# EAGLE design LPC_2TE_3.4 (EAGLE 5.03)
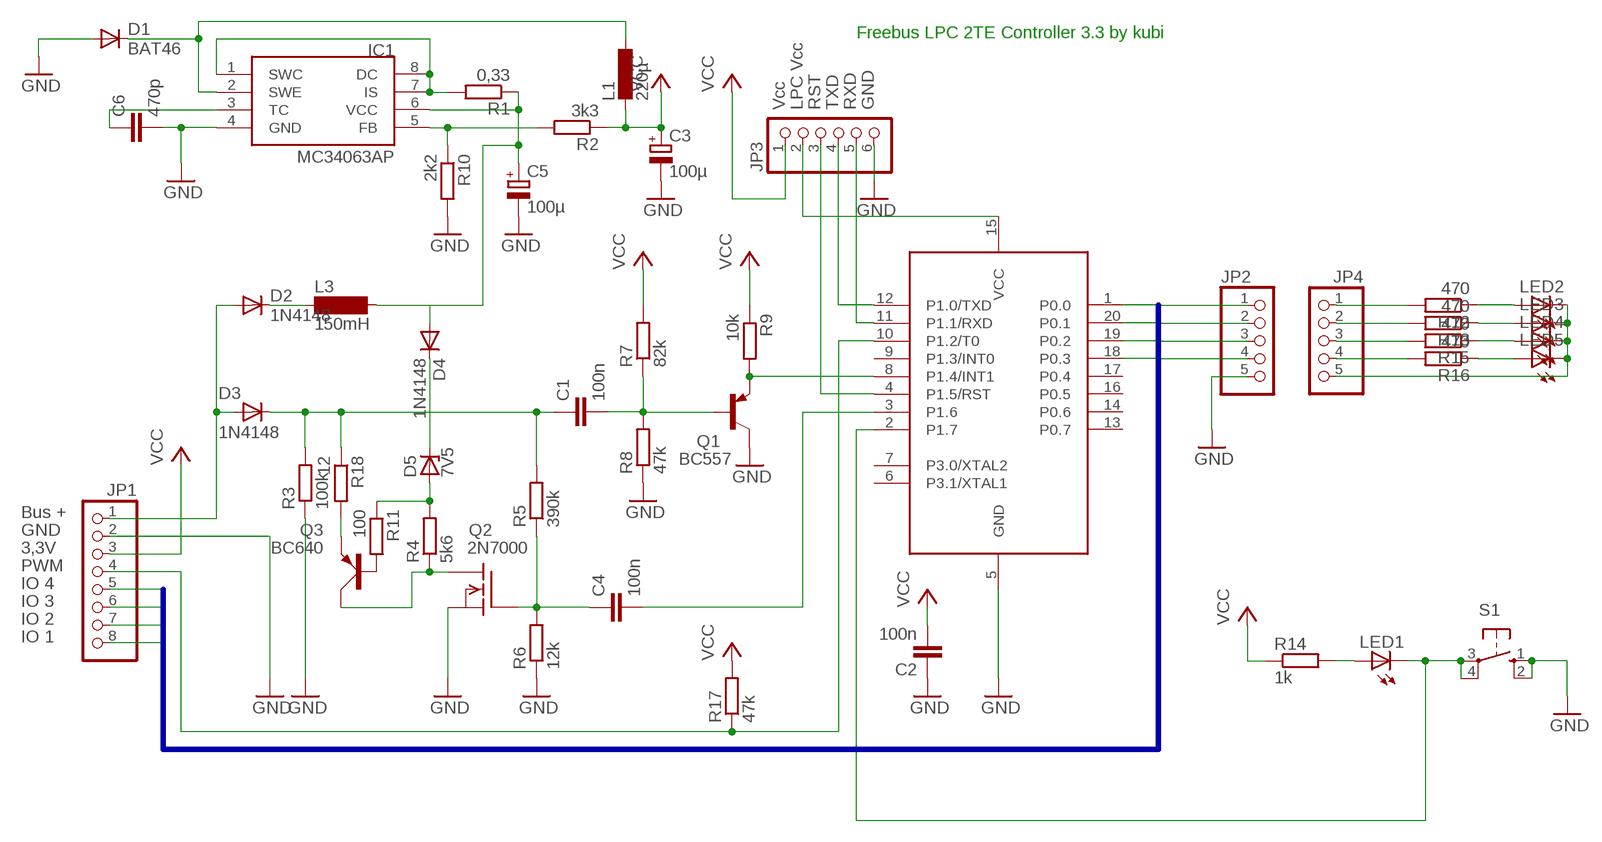
[diagram p0: schematic, sheet 1]

## Parts
C1  100n  C-EU050-024X044  [C050-024X044]
C2  100n  C-EU050-024X044  [C050-024X044]
C3  100µ  CPOL-EUE3.5-8  [E3,5-8]
C4  100n  C-EU050-024X044  [C050-024X044]
C5  100µ  CPOL-EUE3.5-8  [E3,5-8]
C6  470p  C-EU025-024X044  [C025-024X044]
D1  BAT46  BAT81  [DO34-7]
D2  1N4148  [DO35-10]
D3  1N4148  DO35-STEHEND  [DO35-S]
D4  1N4148  [DO35-10]
D5  7V5  ZPD  [DO35Z10]
IC1  MC34063AP  [DIL08]
JP1  PINHD-1X8  [1X08]
JP2  PINHD-1X5  [1X05]
JP3  PINHD-1X6  [1X06]
JP4  PINHD-1X5  [1X05]
L1  220µ  L-EU0207/2V  [0207/2V]
L3  150mH  BS11  [BS11]
LED1  LED3MM  [LED3MM]
LED2  LED3MM  [LED3MM]
LED3  LED3MM  [LED3MM]
LED4  LED3MM  [LED3MM]
LED5  LED3MM  [LED3MM]
Q1  BC557  [TO92]
Q2  2N7000  VN2222KM  [TO237]
Q3  BC640  [SOT54D]
R1  0,33  R-EU_0207/2V  [0207/2V@1]
R2  3k3  R-EU_0207/2V  [0207/2V@1]
R3  100k  R-EU_0207/2V  [0207/2V@1]
R4  5k6  R-EU_0207/2V  [0207/2V@1]
R5  390k  R-EU_0207/2V  [0207/2V@1]
R6  12k  R-EU_0207/2V  [0207/2V@1]
R7  82k  R-EU_0207/2V  [0207/2V@1]
R8  47k  R-EU_0207/2V  [0207/2V@1]
R9  10k  R-EU_0207/2V  [0207/2V@1]
R10  2k2  R-EU_0207/2V  [0207/2V@1]
R11  100  R-EU_0207/2V  [0207/2V@1]
R12  470  R-EU_0207/10  [0207/10@1]
R13  470  R-EU_0207/10  [0207/10@1]
R14  1k  R-EU_0207/2V  [0207/2V@1]
R15  470  R-EU_0207/10  [0207/10@1]
R16  470  R-EU_0207/10  [0207/10@1]
R17  47k  R-EU_0207/2V  [0207/2V@1]
R18  12  R-EU_0207/2V  [0207/2V@1]
S1  10-XX  [B3F-10XX]
U1  89LPC922  [DIL20]

## Nets
GND: C2.1 C3.- C5.- C6.2 D1.A IC1.4(GND) JP1.2 JP2.5 JP3.6 Q1.3(C) Q2.3(S) R3.1 R6.1 R8.1 R10.2 S1.1(S) S1.2(S1) U1.5(GND)
N$1: Q1.1(E) R9.2 U1.8(P1.4/INT1)
N$2: C1.2 Q1.2(B) R7.1 R8.2
N$3: JP1.4 R17.1 U1.10(P1.2/T0)
N$4: C1.1 D3.P$2(B) R3.2 R5.2 R18.1
N$5: C4.2 U1.3(P1.6)
N$6: D2.A D3.P$1(A) JP1.1
N$7: LED1.K(C) S1.3(P) S1.4(P1) U1.2(P1.7)
N$8: IC1.1(SWC) IC1.7(IS) IC1.8(DC) R1.2
N$9: LED1.A R14.2
N$10: C5.+ D4.A IC1.6(VCC) L3.2 R1.1
N$11: IC1.5(FB) R2.2 R10.1
N$12: D1.C IC1.2(SWE) L1.1
N$13: D2.C L3.1
N$14: C6.1 IC1.3(TC)
N$15: D4.C D5.C
N$16: JP4.1 R12.2
N$17: JP4.2 R13.2
N$18: JP4.3 R15.2
N$19: JP4.4 R16.2
N$20: LED2.A R12.1
N$21: LED3.A R13.1
N$22: LED4.A R15.1
N$23: LED5.A R16.1
N$24: JP4.5 LED2.K(C) LED3.K(C) LED4.K(C) LED5.K(C)
N$25: D5.A R4.2 R11.1
N$26: Q2.1(D) Q3.C R4.1
N$28: Q3.B R11.2
N$29: JP3.4 U1.12(P1.0/TXD)
N$30: JP3.5 U1.11(P1.1/RXD)
N$31: JP3.3 U1.4(P1.5/RST)
N$32: JP3.2 U1.15(VCC)
N$33: Q3.E R18.2
N$34: C4.1 Q2.2(G) R5.1 R6.2
P0.0: JP1.8 JP2.1 U1.1(P0.0)
P0.1: JP1.7 JP2.2 U1.20(P0.1)
P0.2: JP1.6 JP2.3 U1.19(P0.2)
P0.3: JP1.5 JP2.4 U1.18(P0.3)
VCC: C2.2 C3.+ JP1.3 JP3.1 L1.2 R2.1 R7.2 R9.1 R14.1 R17.2
Unconnected: U1.6(P3.1/XTAL1) U1.7(P3.0/XTAL2) U1.9(P1.3/INT0) U1.13(P0.7) U1.14(P0.6) U1.16(P0.5) U1.17(P0.4)

## Buses
P0.[0..3]

## Notes on the sheet
- Freebus LPC 2TE Controller 3.3 by kubi
- Vcc | LPC Vcc | RST | TXD | RXD | GND
- Bus +
- GND
- 3,3V
- PWM
- IO 4
- IO 3
- IO 2
- IO 1

## Library data of the parts
C1 C2 C4 C6 = rcl:C-EU: CAPACITOR, European symbol
C3 C5 = rcl:CPOL-EU: POLARIZED CAPACITOR, European symbol
D1 = diode:BAT81: DIODE barrier diode
D2 D4 = diode:1N4148: DIODE high speed (Philips)
D3 = kubi:DO35-STEHEND
D5 = diode:ZPD: Z DIODE 500 mW
IC1 = mc34063:MC34063
JP1 = pinhead:PINHD-1X8: PIN HEADER
JP2 JP4 = pinhead:PINHD-1X5: PIN HEADER
JP3 = pinhead:PINHD-1X6: PIN HEADER
L1 = rcl:L-EU: INDUCTOR, European symbol
L3 = inductor-neosid:BS: INDUCTOR nominal inductance, magnetically screened
LED1-LED5 = led:LED: LED OSRAM: - CHIPLED LG R971, LG N971, LY N971, LG Q971, LY Q971, LO R971, LY R971 LH N974, LH R974 LS Q976, LO Q976, LY Q976 LO Q996 - Hyper CHIPLED LW Q18S LB Q993, LB Q99A, LB R99A - SideLED LS A670, LO A670, LY A670, LG A670, LP A670 LB A673, LV A673, LT A673, LW A673 LH A674 LY A675 LS A676, LA A676, LO A676, LY A676, LW A676 LS A679, LY A679, LG A679 - Hyper Micro SIDELED® LS Y876, LA Y876, LO Y876, LY Y876 LT Y87S - SmartLED LW L88C, LW L88S LB L89C, LB L89S, LG L890 LS L89K, LO L89K, LY L89K LS L896, LA L896, LO L896, LY L896 - TOPLED LS T670, LO T670, LY T670, LG T670, LP T670 LSG T670, LSP T670, LSY T670, LOP T670, LYG T670 LG T671, LOG T671, LSG T671 LB T673, LV T673, LT T673, LW T673 LH T674 LS T676, LA T676, LO T676, LY T676, LB T676, LH T676, LSB T676, LW T676 LB T67C, LV T67C, LT T67C, LS T67K, LO T67K, LY T67K, LW E67C LS E67B, LA E67B, LO E67B, LY E67B, LB E67C, LV E67C, LT E67C LW T67C LS T679, LY T679, LG T679 LS T770, LO T770, LY T770, LG T770, LP T770 LB T773, LV T773, LT T773, LW T773 LH T774 LS E675, LA E675, LY E675, LS T675 LS T776, LA T776, LO T776, LY T776, LB T776 LHGB T686 LT T68C, LB T68C - Hyper Mini TOPLED® LB M676 - Mini TOPLED Santana® LG M470 LS M47K, LO M47K, LY M47K Source: http://www.osram.convergy.de - LUMILED® LXK2-PW12-R00, LXK2-PW12-S00, LXK2-PW14-U00, LXK2-PW14-V00 LXK2-PM12-R00, LXK2-PM12-S00, LXK2-PM14-U00 LXK2-PE12-Q00, LXK2-PE12-R00, LXK2-PE12-S00, LXK2-PE14-T00, LXK2-PE14-U00 LXK2-PB12-K00, LXK2-PB12-L00, LXK2-PB12-M00, LXK2-PB14-N00, LXK2-PB14-P00, LXK2-PB14-Q00 LXK2-PR12-L00, LXK2-PR12-M00, LXK2-PR14-Q00, LXK2-PR14-R00 LXK2-PD12-Q00, LXK2-PD12-R00, LXK2-PD12-S00 LXK2-PH12-R00, LXK2-PH12-S00 LXK2-PL12-P00, LXK2-PL12-Q00, LXK2-PL12-R00 Source: www.luxeon.com
Q1 = transistor-pnp:BC557: PNP Transistor
Q2 = transistor-fet:VN2222KM: N-Channel Enhancement MOSFET (VMOS); 60V; 0,5A; 7,5Ohm
Q3 = transistor-small-signal:BC640: PNP TRANSISTOR
R1-R18 = rcl:R-EU_: RESISTOR, European symbol
S1 = switch-omron:10-XX: OMRON SWITCH
U1 = micro-philips:89LPC922

## Board
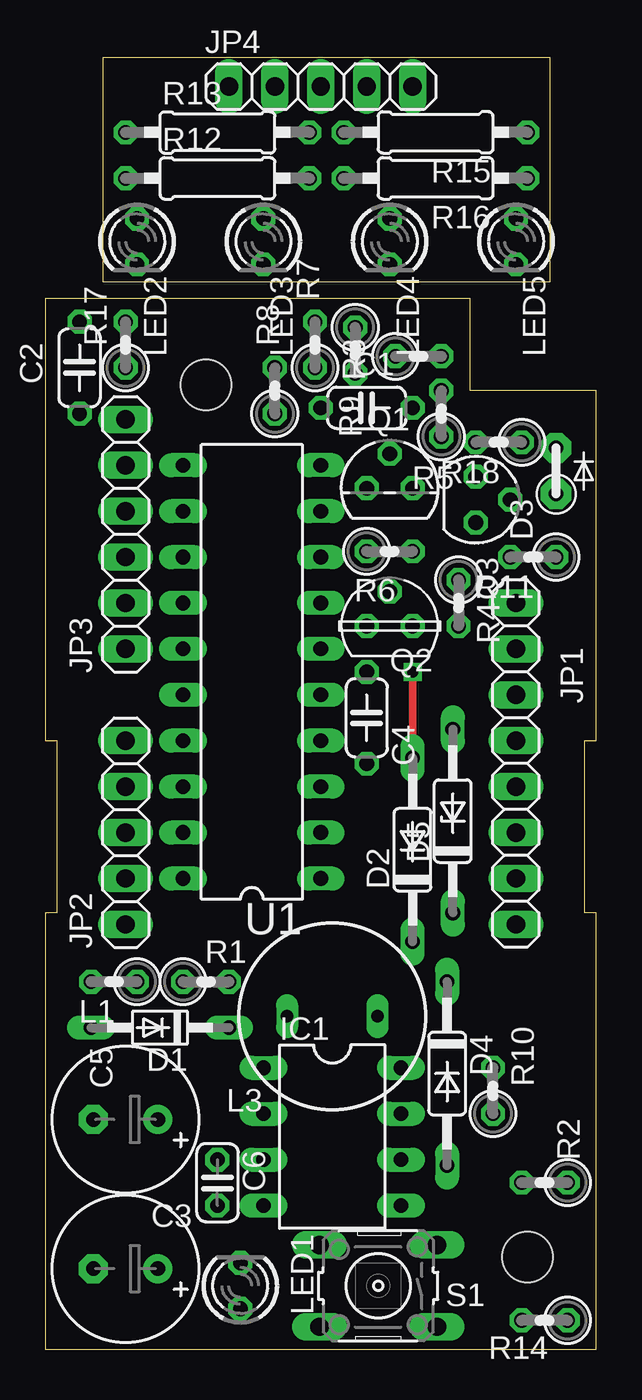
[diagram p1: board, top side]
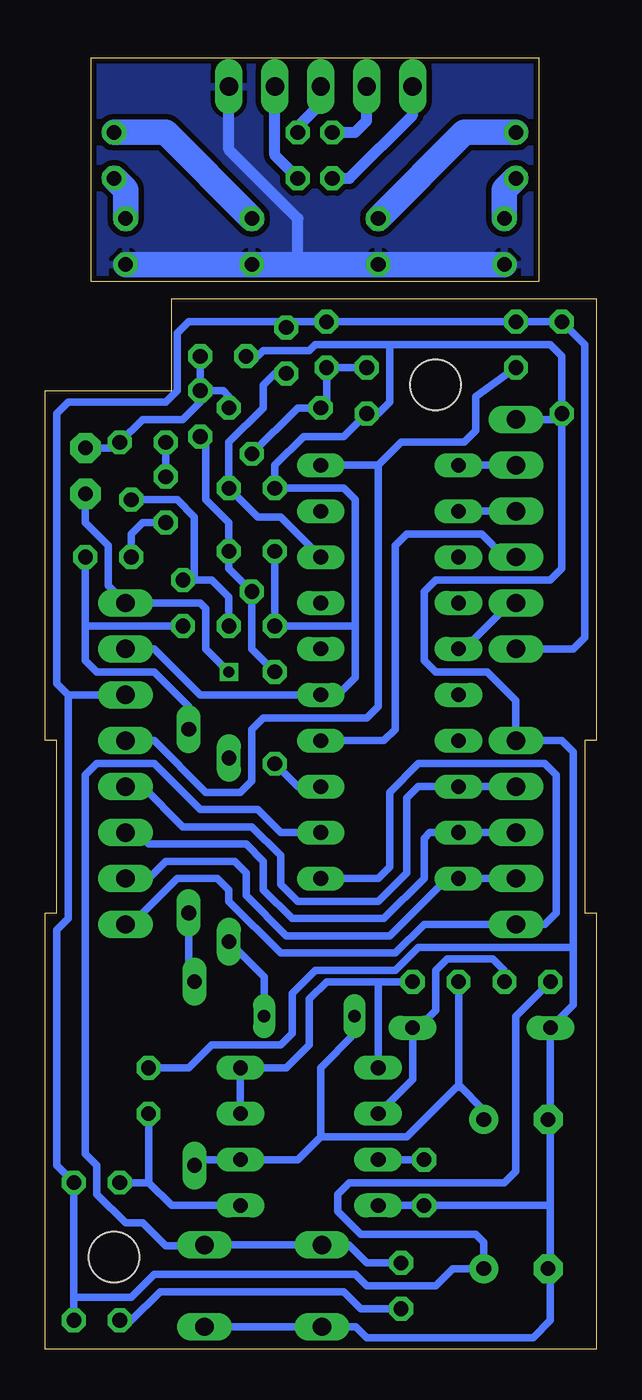
[diagram p2: board, bottom side, seen from below]

Size 30.48 x 71.44 mm. Coordinates in mm from the lower left corner, seen from the top.
Outline: 0,0 30.48,0 30.48,24.13 29.84,24.13 29.84,33.66 30.48,33.66 30.48,53.02 23.5,53.02 23.5,58.1 0,58.1 0,33.66 0.64,33.66 0.64,24.13 0,24.13 0,0
Outline: 3.17,59.05 27.94,59.05 27.94,71.44 3.17,71.44 3.17,59.05
Copper layers (1*16): Top 0.035mm / dielectric 1.5mm / Bottom 0.035mm
Design rules "default *": minimum track width 10mil, minimum drill 24mil, track to track 12mil, track to pad 12mil, pad to pad 12mil, via to via 12mil, smd to smd 8mil, copper to edge 12mil, drill to drill 8mil, minimum pad ring 10mil, minimum via ring 8mil, stop-mask expansion 4mil, vias tented up to drill 0mil, thermal gap 10mil
Holes 2.8 mm at 26.67,5.08 8.89,53.34

### Footprints (pad centres in the part's own frame; a part is rotated, then mirrored left to right if it is on the bottom)
C050-024X044 = drill 0.813 octagon: 1 -2.54,0; 2 2.54,0
E3,5-8 = drill 0.813 pad 1.6 round: + -1.778,0 | drill 0.813 pad 1.6 octagon: - 1.778,0
C025-024X044 = drill 0.813 octagon: 1 -1.27,0; 2 1.27,0
DO34-7 = drill 0.813 long: A 3.81,0; C -3.81,0
DO35-10 = drill 0.813 long: A 5.08,0; C -5.08,0
DO35-S = drill 0.8 pad 1.676 octagon: P$1 -1.27,0; P$2 1.27,0
DO35Z10 = drill 0.813 long: A 5.08,0; C -5.08,0
DIL08 = drill 0.813 long: 1 -3.81,-3.81; 2 -1.27,-3.81; 3 1.27,-3.81; 4 3.81,-3.81; 5 3.81,3.81; 6 1.27,3.81; 7 -1.27,3.81; 8 -3.81,3.81
1X08 = drill 1.016 long: 1 -8.89,0; 2 -6.35,0; 3 -3.81,0; 4 -1.27,0; 5 1.27,0; 6 3.81,0; 7 6.35,0; 8 8.89,0
1X05 = drill 1.016 long: 1 -5.08,0; 2 -2.54,0; 3 0,0; 4 2.54,0; 5 5.08,0
1X06 = drill 1.016 long: 1 -6.35,0; 2 -3.81,0; 3 -1.27,0; 4 1.27,0; 5 3.81,0; 6 6.35,0
0207/2V = drill 0.813 octagon: 1 -1.27,0; 2 1.27,0
BS11 = drill 0.7 long: 1 -2.5,0; 2 2.5,0
LED3MM = drill 0.813 octagon: A -1.27,0; K 1.27,0
TO92 = drill 0.813 octagon: 1 1.27,0; 2 0,1.905; 3 -1.27,0
TO237 = drill 0.813 octagon: 1 1.27,0; 2 0,1.905; 3 -1.27,0
SOT54D = drill 0.813 octagon: B 1.27,0; C 0,1.905; E -1.27,0
0207/2V@1 = drill 0.813 octagon: 1 -1.27,0; 2 1.27,0
0207/10@1 = drill 0.813 octagon: 1 -5.08,0; 2 5.08,0
B3F-10XX = drill 1.016 long: 1 -3.251,2.261; 2 3.251,2.261; 3 -3.251,-2.261; 4 3.251,-2.261
DIL20 = drill 0.813 long: 1 -11.43,-3.81; 2 -8.89,-3.81; 3 -6.35,-3.81; 4 -3.81,-3.81; 5 -1.27,-3.81; 6 1.27,-3.81; 7 3.81,-3.81; 8 6.35,-3.81; 9 8.89,-3.81; 10 11.43,-3.81; 11 11.43,3.81; 12 8.89,3.81; 13 6.35,3.81; 14 3.81,3.81; 15 1.27,3.81; 16 -1.27,3.81; 17 -3.81,3.81; 18 -6.35,3.81; 19 -8.89,3.81; 20 -11.43,3.81

### Placement (x,y rotation side)
C1  17.78,52.07 180 top
C2  1.91,54.29 90 top
C3  4.45,4.45 180 top
C4  17.78,34.92 270 top
C5  4.45,12.7 180 top
C6  9.53,9.21 270 top
D1  6.35,17.78 180 top
D2  20.32,27.62 90 top
D3  28.26,48.58 90 top
D4  22.23,15.24 270 top
D5  22.54,29.21 90 top
IC1  15.88,11.75 270 top
JP1  26.04,32.38 270 top
JP2  4.45,28.57 90 top
JP3  4.45,45.09 90 top
JP4  15.24,69.85 0 top
L1  3.81,20.32 180 top
L3  15.88,18.41 180 top
LED1  10.79,3.49 90 top
LED2  5.08,61.28 270 top
LED3  12.06,61.28 270 top
LED4  19.05,61.28 270 top
LED5  26.04,61.28 270 top
Q1  19.05,47.62 0 top
Q2  19.05,40.01 0 top
Q3  23.81,46.99 270 top
R1  8.89,20.32 0 top
R2  27.62,9.21 180 top
R3  20.64,54.93 0 top
R4  22.86,41.27 270 top
R5  21.91,51.75 90 top
R6  19.05,44.13 0 top
R7  14.92,55.56 90 top
R8  12.7,53.02 90 top
R9  17.14,55.24 270 top
R10  24.77,14.29 90 top
R11  26.99,43.81 180 top
R12  9.53,64.77 0 top
R13  9.53,67.31 0 top
R14  27.62,1.59 180 top
R15  21.59,67.31 180 top
R16  21.59,64.77 180 top
R17  4.45,55.56 90 top
R18  25.08,50.16 180 top
S1  18.41,3.49 180 top
U1  11.43,37.47 90 top

### Tracks (layer width: path | path; a pad name or v marks a point on that pad's centre or on a via)
GND
  Bottom 0.406: 13.34,40.01 Q2.3 R6.1 | 13.34,40.01 13.34,46.99 13.97,47.62 Q1.3 17.78,48.9 16.19,50.48 13.97,50.48 R8.1 12.06,51.75 11.43,52.39 11.43,55.56 | S1.1 15.28,1.23 15.24,1.27 15.16,1.19 S1.2 13.3,1.23 12.7,0.64 3.49,0.64 2.54,1.59 2.54,4.45 | 13.34,40.01 13.34,37.15 14.29,36.2 U1.5 21.91,36.2 24.45,38.73 JP1.2 25.72,38.73 | 1.91,51.44 1.91,43.18 2.54,42.55 8.89,42.55 9.53,41.91 9.53,38.1 8.89,37.47 6.03,37.47 4.45,35.88 JP2.5 1.91,33.66 1.27,33.02 1.27,22.23 | 1.91,51.44 C2.1 1.91,54.93 2.54,55.56 11.43,55.56 | 1.91,51.44 JP3.6 | IC1.4 C6.2 2.54,7.94 | 1.27,22.23 1.27,19.05 D1.A 2.54,12.7 | 2.54,12.7 C5.- | 2.54,4.45 C3.- | 2.54,7.94 2.54,12.7 | 2.54,4.45 2.54,7.94 | R3.1 18.73,54.93 18.41,55.24 15.88,55.24 15.56,55.56 11.43,55.56 | R10.2 22.54,15.56 21.27,16.83 17.46,16.83 16.83,17.46 16.83,19.68 15.56,20.95 11.11,20.95 9.84,22.23 1.27,22.23
N$1
  Bottom 0.406: U1.8 17.46,46.04 18.73,46.04 Q1.1 20.32,50.16 18.41,52.07 18.41,53.34 17.78,53.98 R9.2
N$2
  Bottom 0.406: R8.2 R7.1 14.92,52.39 C1.2 16.51,52.07 Q1.2
N$3
  Bottom 0.406: 12.06,48.9 12.06,35.56 12.7,34.92 18.41,34.92 19.05,34.29 19.05,31.43 19.68,30.8 21.59,30.8 24.45,33.66 JP1.4 | 12.06,48.9 U1.10 | 12.06,48.9 10.79,50.16 7.3,50.16 6.67,50.8 6.67,52.7 R17.1
N$4
  Bottom 0.406: R5.2 21.91,52.39 22.86,51.44 25.08,51.44 R18.1 26.67,49.85 D3.P$2 | C1.1 20.32,52.7 20.64,53.02 R5.2 | R5.2 R3.2
N$5
  Bottom 0.406: C4.2 16.51,31.11 U1.3
N$6  (via drill 0.6)
  Top 0.406: v20.32,37.47 D2.A
  Bottom 0.406: D3.P$1 28.26,45.72 26.99,44.45 26.99,42.23 JP1.1 21.91,41.27 21.59,40.96 21.59,38.73 v20.32,37.47
N$7
  Bottom 0.406: LED1.K 12.7,4.76 13.69,5.75 S1.4 15.16,5.96 15.24,6.03 15.52,5.75 S1.3 21.63,5.75 21.59,5.71 23.81,5.71 25.08,6.99 26.04,6.99 27.62,8.57 27.62,10.16 28.26,10.79 28.26,31.75 27.62,32.38 24.45,32.38 21.91,29.84 18.73,29.84 17.46,28.57 U1.2
N$8
  Bottom 0.406: IC1.7 IC1.8 17.14,15.56 15.88,16.83 15.88,19.37 14.92,20.32 12.06,20.32 | 12.06,20.32 R1.2 | IC1.1 12.06,20.32
N$9
  Bottom 0.406: LED1.A 13.02,2.22 13.97,3.17 24.13,3.17 25.72,1.59 R14.2
N$10
  Bottom 0.406: 15.24,11.75 16.51,10.48 IC1.6 21.91,10.48 D4.A | 15.24,11.75 10.48,11.75 7.75,14.48 7.62,14.48 7.62,14.61 | L3.2 13.38,17.42 15.24,15.56 15.24,11.75 | 7.62,14.61 R1.1 | C5.+ 6.22,13.21 7.62,14.61
N$11
  Bottom 0.406: IC1.5 23.5,7.94 24.77,9.21 | 24.77,9.21 R10.1 | 24.77,9.21 R2.2
N$12
  Bottom 0.406: IC1.2 10.16,14.92 D1.C 9.84,17.78 8.89,18.73 8.89,20.95 8.26,21.59 5.71,21.59 5.08,20.95 L1.1
N$13
  Bottom 0.406: L3.1 18.38,20.6 D2.C
N$14
  Bottom 0.406: C6.1 IC1.3
N$15
  Bottom 0.406: D4.C 22.54,20.95 D5.C
N$16
  Bottom 0.61: JP4.1 10.16,68.26 13.65,64.77 R12.2
N$17
  Bottom 0.61: JP4.2 12.7,67.94 13.34,67.31 R13.2
N$18
  Bottom 0.61: R15.2 16.51,67.63 15.24,68.9 JP4.3
N$19
  Bottom 0.61: JP4.4 17.78,66.04 R16.2
N$20
  Bottom 1.422: R12.1 5.08,64.14 LED2.A
N$21
  Bottom 1.422: R13.1 7.3,67.31 LED3.A
N$22
  Bottom 1.422: LED4.A 23.81,67.31 R15.1
N$23
  Bottom 1.422: LED5.A 26.04,64.14 R16.1
N$24
  Bottom 0.61: JP4.5 20.32,66.36 16.51,62.55 16.51,60.01
  Bottom 1.422: LED2.K LED3.K 16.51,60.01 LED4.K LED5.K
  pour Bottom: 3.17,71.44 3.17,59.05 27.94,59.05 27.94,71.44
N$25
  Bottom 0.406: D5.A 22.54,35.56 24.45,37.47 27.62,37.47 28.26,38.1 28.26,40.01 | 28.26,40.01 R11.1 | 28.26,40.01 R4.2
N$26
  Bottom 0.406: Q3.C 23.18,46.99 22.23,46.04 22.23,42.55 | Q2.1 20.32,41.59 21.27,42.55 22.23,42.55 | 22.23,42.55 R4.1
N$28
  Bottom 0.406: R11.2 25.72,45.09 25.08,45.72 Q3.B
N$29
  Bottom 0.406: JP3.4 U1.12
N$30
  Bottom 0.406: JP3.5 U1.11
N$31
  Bottom 0.406: U1.4 11.75,33.66 11.11,34.29 11.11,44.45 10.48,45.09 6.35,45.09 5.08,43.81 JP3.3
N$32
  Bottom 0.406: JP3.2 4.76,41.27 7.3,38.73 U1.15
N$33
  Bottom 0.406: R18.2 Q3.E
N$34
  Bottom 0.406: C4.1 19.05,38.73 Q2.2 20.32,43.18 R6.2 20.32,45.72 21.59,46.99 21.59,50.16 R5.1
P0.0
  Bottom 0.406: U1.1 12.06,26.04 11.43,26.67 11.43,30.8 9.84,32.38 2.86,32.38 2.22,31.75 2.22,24.13 2.86,23.5 JP2.1 9.53,23.5 11.11,21.91 17.46,21.91 20.32,24.77 20.32,25.4 20.95,26.04 23.18,26.04 25.72,23.5 JP1.8
P0.1
  Bottom 0.406: JP2.2 U1.20 8.26,26.04 11.43,22.86 17.14,22.86 19.37,25.08 19.37,26.35 20,26.99 23.81,26.99 24.77,26.04 JP1.7
P0.2
  Bottom 0.406: JP2.3 U1.19 9.21,28.57 9.53,28.26 9.53,26.04 11.75,23.81 16.83,23.81 18.41,25.4 18.41,26.99 19.37,27.94 24.77,27.94 25.4,28.57 JP1.6
P0.3
  Bottom 0.406: JP2.4 U1.18 9.84,31.11 10.48,30.48 10.48,26.35 12.06,24.77 16.51,24.77 17.46,25.72 17.46,27.3 19.05,28.89 22.86,28.89 25.08,31.11 JP1.5
VCC
  Bottom 0.406: JP3.1 1.27,38.73 0.64,39.37 0.64,55.56 C2.2 R17.2 R7.2 17.14,56.83 | 17.14,56.83 22.54,56.83 23.18,56.2 23.18,53.02 23.81,52.39 29.21,52.39 29.84,51.75 29.84,36.83 29.21,36.2 | 17.14,56.83 R9.1 | 28.89,2.86 R14.1 | 28.89,2.86 R2.1 29.84,10.16 29.84,23.18 29.21,23.81 29.21,36.2 | 28.89,2.86 25.72,2.86 24.45,4.13 13.34,4.13 12.7,3.49 8.89,3.49 7.94,4.45 C3.+ 6.22,5.91 6.67,6.35 13.02,6.35 14.29,7.62 14.29,8.57 13.65,9.21 5.08,9.21 4.45,9.84 4.45,18.41 L1.2 | 29.21,36.2 JP1.3